# Altium schematic sheet UI.SchDoc
size A; SheetNumber: 3; SheetTotal: 5
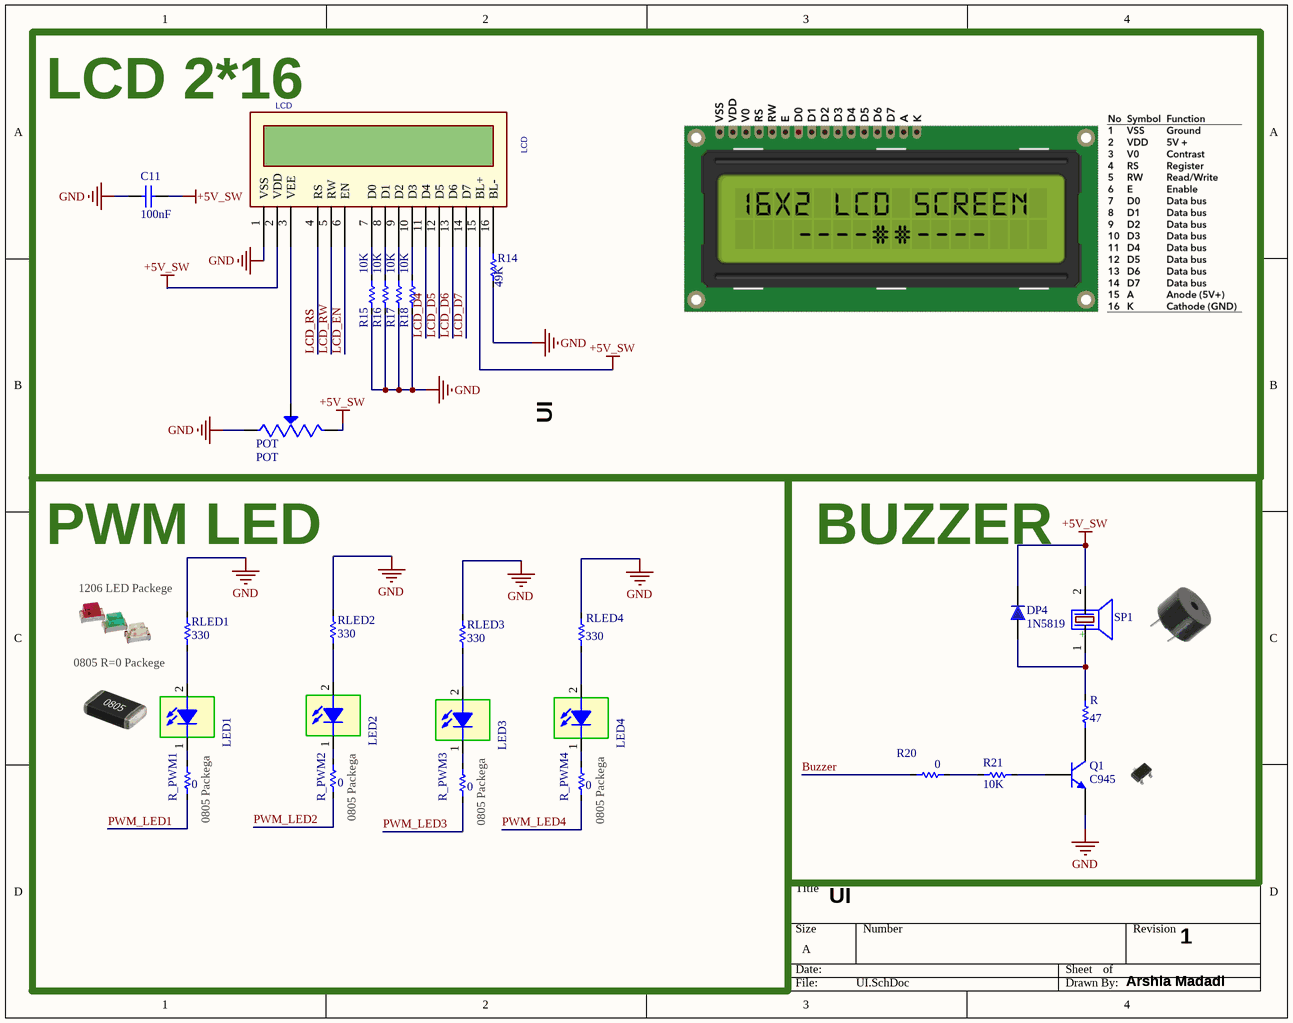
[diagram p0: UI.SchDoc]

## Parts
C11  100nF  [CAPC4817X12N]
DP4  1N5819  [430X270D]
LCD  LCD  [LCD_2X16 BLUE - 2.5mm]
LED1  SMD 1206 LED  [LED 1206]  (value not drawn)
LED2  SMD 1206 LED  [LED 1206]  (value not drawn)
LED3  SMD 1206 LED  [LED 1206]  (value not drawn)
LED4  SMD 1206 LED  [LED 1206]  (value not drawn)
POT  POT  [TRIM_3296W1103LF]
Q1  C945  [SOT23_M]
R  47  [1206_Res]
R14  49K  [1206_Res]
R15  10K  [1206_Res]
R16  10K  [1206_Res]
R17  10K  [1206_Res]
R18  10K  [1206_Res]
R20  0  [0805]
R21  10K  [1206_Res]
R_PWM1  0  [0805]
R_PWM2  0  [0805]
R_PWM3  0  [0805]
R_PWM4  0  [0805]
RLED1  330  [1206_Res]
RLED2  330  [1206_Res]
RLED3  330  [1206_Res]
RLED4  330  [1206_Res]
SP1  (no value)  [BUZZER 7.62mm DC]

## Blocks framed on the sheet
LCD 2*16: C11 LCD POT R14-R18
PWM LED: LED1-LED4 R_PWM1-R_PWM4 RLED1-RLED4
BUZZER: DP4 Q1 R R20 R21 SP1

## Nets
+5V_SW: C11.2 DP4.2 LCD.2(VDD) LCD.15(BL+) POT.3(CW) SP1.2(-)
GND: C11.1 LCD.1(VSS) POT.1(CCW) Q1.2(E) R14.2 R15.1 R16.1 R17.1 R18.1 RLED1.2 RLED2.2 RLED3.2 RLED4.2
Buzzer: R20.2
LCD_D4: LCD.11(D4)
LCD_D5: LCD.12(D5)
LCD_D6: LCD.13(D6)
LCD_D7: LCD.14(D7)
LCD_EN: LCD.6(EN)
LCD_RS: LCD.4(RS)
LCD_RW: LCD.5(RW)
PWM_LED1: R_PWM1.1
PWM_LED2: R_PWM2.1
PWM_LED3: R_PWM3.1
PWM_LED4: R_PWM4.1
NetDP4_1: DP4.1 R.2 SP1.1(+)
NetLCD_3: LCD.3(VEE) POT.2(WIPER)
NetLCD_7: LCD.7(D0) R15.2
NetLCD_8: LCD.8(D1) R16.2
NetLCD_9: LCD.9(D2) R17.2
NetLCD_10: LCD.10(D3) R18.2
NetLCD_16: LCD.16(BL-) R14.1
NetLED1_1: LED1.1 R_PWM1.2
NetLED1_2: LED1.2 RLED1.1
NetLED2_1: LED2.1 R_PWM2.2
NetLED2_2: LED2.2 RLED2.1
NetLED3_1: LED3.1 R_PWM3.2
NetLED3_2: LED3.2 RLED3.1
NetLED4_1: LED4.1 R_PWM4.2
NetLED4_2: LED4.2 RLED4.1
NetQ1_1: Q1.1(B) R21.1
NetQ1_3: Q1.3(C) R.1
NetR20_1: R20.1 R21.2

## Notes on the sheet
- UI
- (near RLED1) 1206 LED Packege
- 0805 R=0 Packege
- 0805 Packega
- 1
- Arshia Madadi

## Library data of the parts
C11 = CAP SMD 1206: CAP 1206; Designer: Abbas Basereh; Desc.: CAP SMD 1206; Data: 16-12-2016
DP4 = 1N5819: Schottkey Rectifiers; Designer: Abbas Basereh; Data: 16-12-2016; Link: *; Part. No: *
LCD = LCD: Alphanumic LCD; Designer: Abbas Basereh; Data: 16-12-2016
LED1-LED4 = LED SMD 1206
POT = 3296W1103LF: Trimmer, Potentiometer 10kohm 25turn Thd; MF: Bourns; Package: None; MP: 3296W1103LF; Check_prices: https://www.snapeda.com/parts/3296W1103LF/Bourns/view-part/2487625/?ref=eda; Availability: Unavailable; Price: None; Value: *; SnapEDA_Link: https://www.snapeda.com/parts/3296W1103LF/Bourns/view-part/2487625/?ref=snap
Q1 = C945: NPN Silicon Epitaxial Planar Transistor; Published: 2017-2-8; LatestRevisionDate: 2017; LatestRevisionNote: IPC-7351 Footprint Added.; DatasheetVersion: 2017; PackageVersion: 2017-2-8; PackageReference: SOT23; Publisher: Abbas Basereh; PackageDescription: 3-Pin SOT-23 Package 0.95 mm Pitch, 2.3 mm Lead Span; ComponentLink1Description: Manufacturer Link; ComponentLink1URL: http://www.taitroncomponents.com/; ComponentLink2Description: Datasheet; ComponentLink2URL: http://www.taitroncomponents.com/
R R14-R18 R20 R21 R_PWM1-R_PWM4 RLED1-RLED4 = Res: Resistor; Published: 8-Jun-2000; LatestRevisionDate: 17-Jul-2002; LatestRevisionNote: Re-released for DXP Platform.; PackageReference: AXIAL-0.3; Publisher: Altium Limited
SP1 = PIEZO BUZZER: PIEZO BUZZER ACTIVE; Designer: Abbas Basereh; Comment_1: SPEAKER AND BEEP; Design Date: 1395/11/14; ComponentLink2Description: Reference; PackageDescription: THD; Publisher: Abbas Basereh; Mounting Technology: THD; Pin Count: 2; Status: Unreleased